# EAGLE board vr98-north-revA (EAGLE 9.6.2)
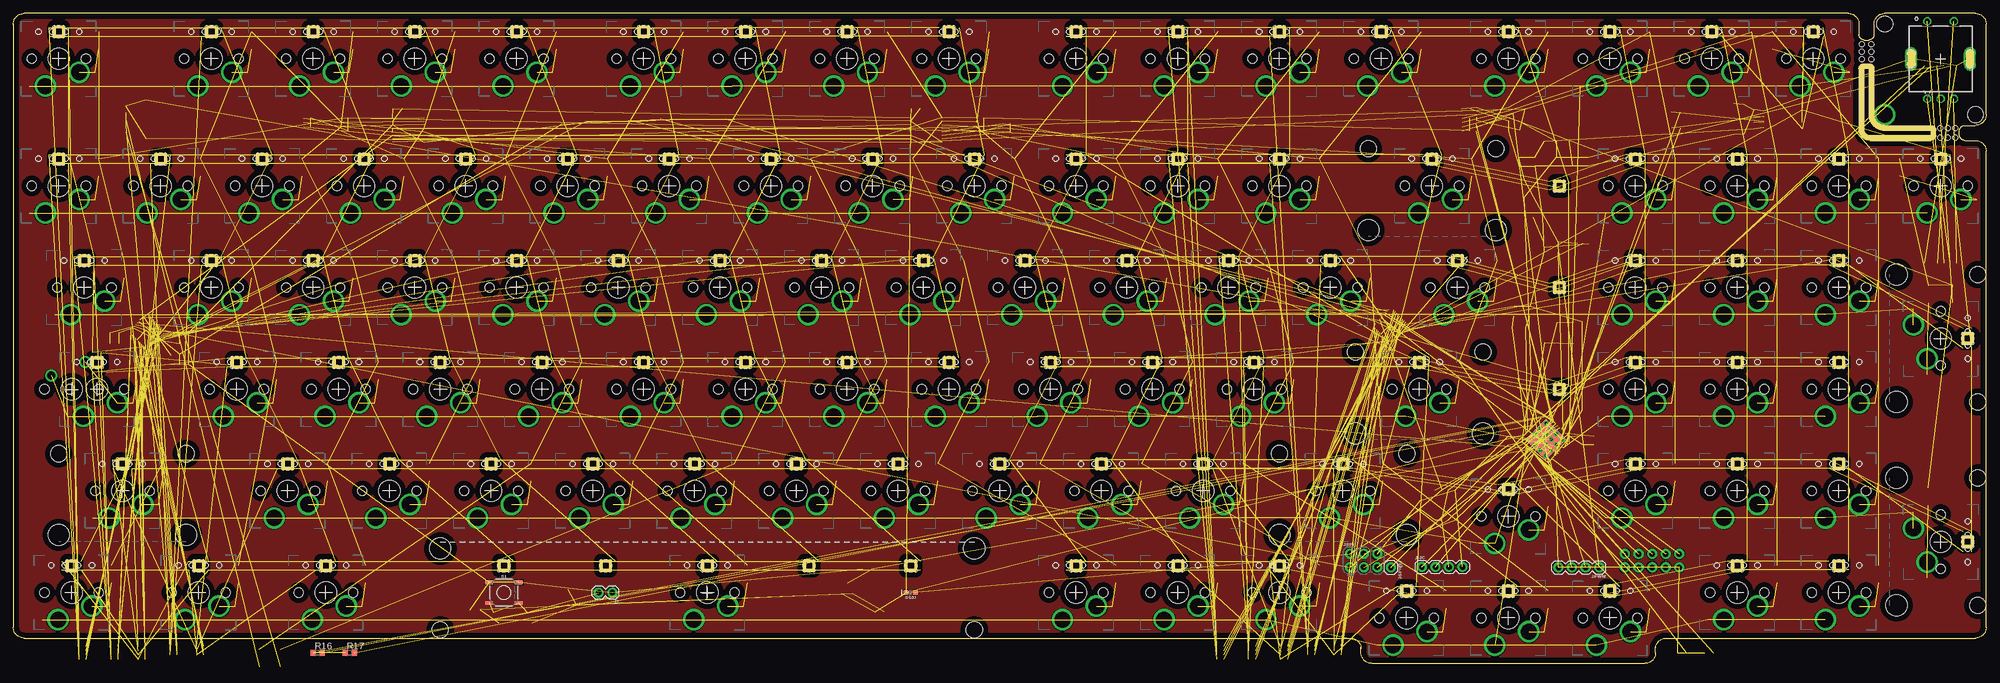
[diagram p4: board, top side]
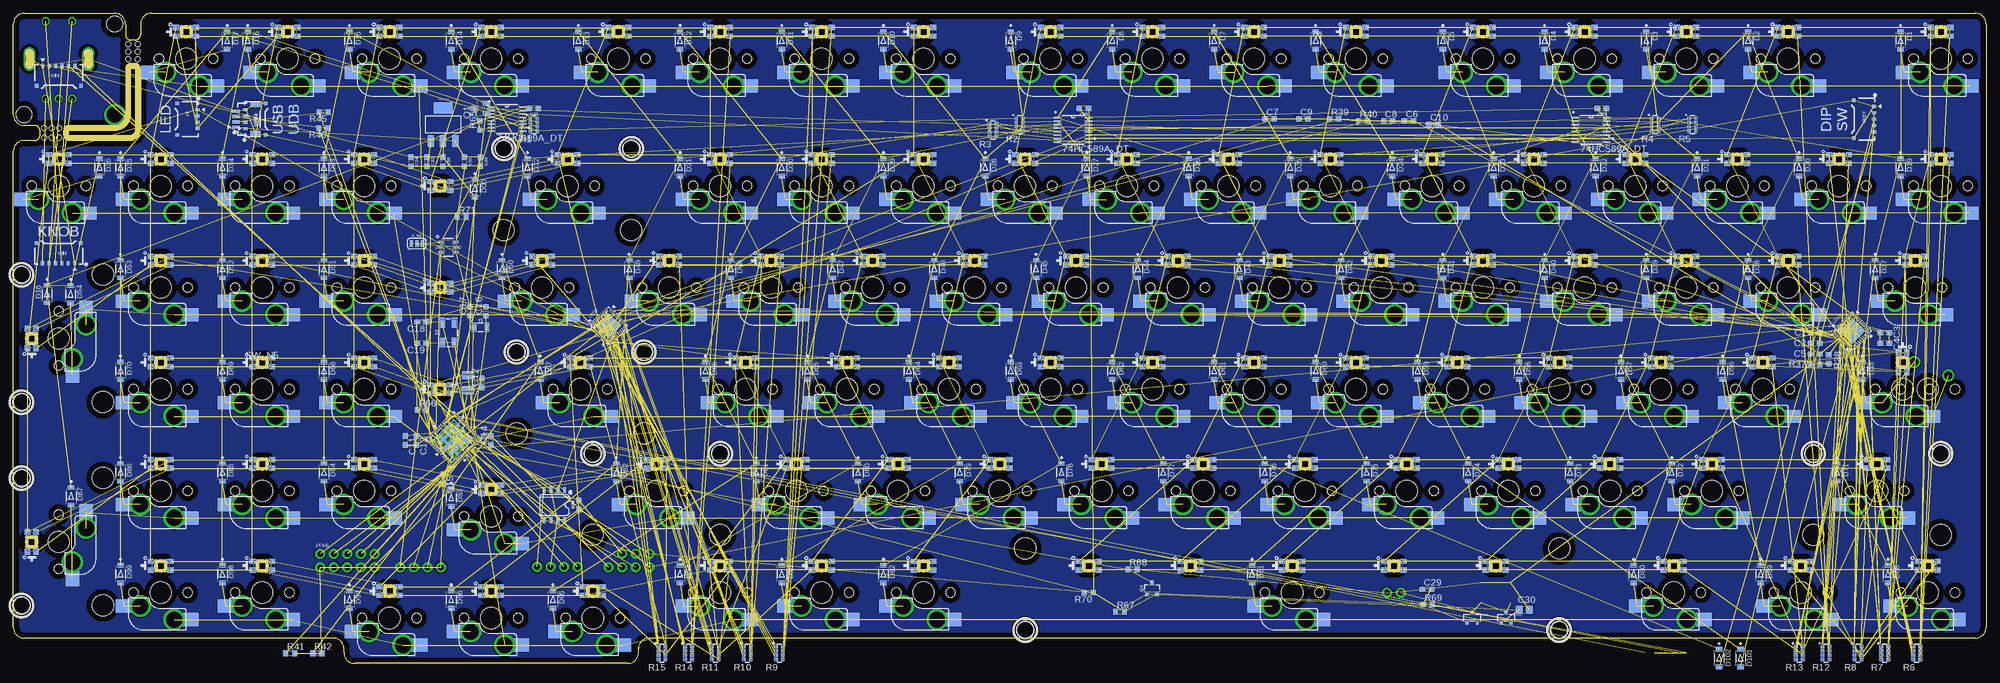
[diagram p5: board, bottom side, seen from below]

Size 369.48 x 121.83 mm. Coordinates in mm from the lower left corner, seen from the top.
Outline: 252.41,2.76 252.41,2 arc90 254.41,0 305.56,0 arc90 307.56,2 307.56,2.76
Outline: 252.41,2.76 252.41,3
Outline: 307.56,2.76 307.56,3
Outline: 307.56,2.76 arc-90 309.56,4.76 367.48,4.76 arc90 369.48,6.76 369.48,96.01 arc90 367.48,98.01 365.48,98.01 arc-90 364.48,99.01 364.48,99.83 arc-90 365.48,100.83 367.48,100.83 arc90 369.48,102.83 369.48,119.83 arc90 367.48,121.83 350.48,121.83 arc90 348.48,119.83 348.48,117.83 arc-90 347.48,116.83 346.66,116.83 arc-90 345.66,117.83 345.66,119.83 arc90 343.66,121.83 2,121.83 arc90 0,119.83 0,6.76 arc90 2,4.76 250.41,4.76 arc-90 252.41,2.76
Outline: 347.66,98.01 359.07,98.01 arc79 360.07,99.01 360.07,99.83 arc90 359.07,100.83 350.48,100.83 arc-90 348.48,102.83 348.48,111.42 arc90 347.48,112.42 346.66,112.42 arc90 345.66,111.42 345.66,100.01 arc90 347.66,98.01
Copper layers (1*16): Top 0.035mm / dielectric 1.5mm / Bottom 0.035mm
Design rules "default": minimum track width 6mil, minimum drill 0.35mm, track to track 6mil, track to pad 6mil, pad to pad 6mil, via to via 6mil, smd to smd 6mil, copper to edge 40mil, drill to drill 6mil, minimum pad ring 10mil, minimum via ring 8mil, stop-mask expansion 4mil, vias tented up to drill 0mil, thermal gap 10mil
Holes 3 mm at 350.48,119.83 367.48,102.83
Holes 1 mm at 346.16,113.22 346.16,114.62 346.16,116.03 347.98,113.22 347.98,114.62 347.98,116.03 363.68,100.33 360.88,98.51 362.27,100.33 360.88,100.33 363.68,98.51 362.27,98.51
Milling: 12 lines

## Footprints (pad centres in the part's own frame; a part is rotated, then mirrored left to right if it is on the bottom)
C0603 = smd 1.1 x 1: 1 -0.85,0; 2 0.85,0
0603 = smd 1.1 x 1: 1 -0.85,0; 2 0.85,0
C0805 = smd 1.3 x 1.5: 1 -0.95,0; 2 0.95,0
SOD-123 = smd 0.914 x 1.219: A 1.638,0; C -1.638,0
LED-0603 = smd 1 x 1: A -0.877,0; C 0.877,0
SOT23-R = smd 0.6 x 0.7: 1 -0.95,-1; 2 0.95,-1; 3 0,1
MX-STABS-200U = hole 3.988: -11.938,8.255; 11.938,8.255 | hole 3.048: -11.938,-6.985; 11.938,-6.985
MX-STABS-625U = hole 3.988: -50,8.255; 50,8.255 | hole 3.048: -50,-6.985; 50,-6.985
1X02 = drill 1.016 pad 1.88: 1 0,0; 2 2.54,0
MOLEX_781710004 = smd 0.6 x 0.85: 1 -1.8,2; 2 -0.6,2; 3 0.6,2; 4 1.8,2 | smd 0.7 x 0.8: NC1 -2.95,-1.775; NC2 2.95,-1.775
SMT-JUMPER_3_1-NC_TRACE_SILK = smd 0.635 x 1.27: 1 -1.016,0; 2 0,0; 3 1.016,0
1X04 = drill 1.016 pad 1.88: 1 0,0; 2 2.54,0; 3 5.08,0; 4 7.62,0
MOLEX_781710005 = smd 0.6 x 0.85: 1 -2.4,2; 2 -1.2,2; 3 0,2; 4 1.2,2; 5 2.4,2 | smd 0.7 x 0.8: NC1 -3.55,-1.775; NC2 3.55,-1.775
2X3-NS = drill 1.016 pad 1.88: 1 -2.54,-1.27; 2 -2.54,1.27; 3 0,-1.27; 4 0,1.27; 5 2.54,-1.27; 6 2.54,1.27
1X01 = drill 1.016 pad 1.88: 1 0,0
2X5_NOSILK = drill 1.016 pad 1.88: 1 0,0; 2 0,2.54; 3 2.54,0; 4 2.54,2.54; 5 5.08,0; 6 5.08,2.54; 7 7.62,0; 8 7.62,2.54; 9 10.16,0; 10 10.16,2.54
L3225M = smd 1.6 x 2.2: 1 -1.4,0; 2 1.4,0
SOT223 = smd 1.219 x 2.235: 1 -2.311,-3.099; 2 0,-3.099; 3 2.311,-3.099 | smd 3.6 x 2.2: 4 0,3.099
SOT23 = smd 1 x 1.4: 1 -0.95,-1.1; 2 0.95,-1.1; 3 0,1.1
SOT23-3 = smd 0.8 x 0.9: 1 -0.95,-1; 2 0.95,-1; 3 0,1.1
R0603X4 = smd 0.7 x 0.6: 1 -0.65,1.2; 2 -0.65,0.4; 3 -0.65,-0.4; 4 -0.65,-1.2; 5 0.65,-1.2; 6 0.65,-0.4; 7 0.65,0.4; 8 0.65,1.2
R0603 = smd 1 x 1.1: 1 -0.85,0; 2 0.85,0
TACTILE_SWITCH_SMD_5.2MM = smd 1.524 x 0.762: 1 -2.794,1.905; 2 2.794,1.905; 3 -2.794,-1.905; 4 2.794,-1.905
MX-5-PIN-HOTSWAP-PAD = smd 3.15 x 2.5 bottom: 1@1 -6.785,2.54; 2@1 5.542,5.08 | drill 3 pad 3.75: 1@2 -3.81,2.54; 2@2 2.54,5.08 | hole 3.988: 0,0 | hole 1.75: -5.08,0; 5.08,0
MX-5-PIN-MILMAX-3305-X-NS = drill 1.5: 1 -3.81,2.54; 2 2.54,5.08 | hole 3.988: 0,0 | hole 1.75: -5.08,0; 5.08,0
ROTARY_EC11E = drill 1.5 pad 2 long: 1 -5.5,0; 2 5.5,0 | drill 0.991 pad 1.499 octagon: A -2.489,-7.493; B 2.489,-7.493; C 0,-7.493; D -2.489,7.01; E 2.489,7.01 | hole 1.5: -5.5,1; -5.5,-1; 5.5,1; 5.5,-1
UFQFPN-48_7X7X0P55MM-THERM = smd 0.813 x 0.305: 1 -3.454,2.75; 2 -3.454,2.25; 3 -3.454,1.75; 4 -3.454,1.25; 5 -3.454,0.75; 6 -3.454,0.25; 7 -3.454,-0.25; 8 -3.454,-0.75; 9 -3.454,-1.25; 10 -3.454,-1.75; 11 -3.454,-2.25; 12 -3.454,-2.75; 25 3.454,-2.75; 26 3.454,-2.25; 27 3.454,-1.75; 28 3.454,-1.25; 29 3.454,-0.75; 30 3.454,-0.25; 31 3.454,0.25; 32 3.454,0.75; 33 3.454,1.25; 34 3.454,1.75; 35 3.454,2.25; 36 3.454,2.75 | smd 0.305 x 0.813: 13 -2.75,-3.454; 14 -2.25,-3.454; 15 -1.75,-3.454; 16 -1.25,-3.454; 17 -0.75,-3.454; 18 -0.25,-3.454; 19 0.25,-3.454; 20 0.75,-3.454; 21 1.25,-3.454; 22 1.75,-3.454; 23 2.25,-3.454; 24 2.75,-3.454; 37 2.75,3.454; 38 2.25,3.454; 39 1.75,3.454; 40 1.25,3.454; 41 0.75,3.454; 42 0.25,3.454; 43 -0.25,3.454; 44 -0.75,3.454; 45 -1.25,3.454; 46 -1.75,3.454; 47 -2.25,3.454; 48 -2.75,3.454 | smd 5 x 5.4: 49 0.2,0 | smd 0.4 x 5: 49@1 -2.5,-0.2 | smd 0.56 x 0.29 rotated 45: 49@2 -2.4,2.4 | smd 5.4 x 5.4 bottom: 49@3 0,0 | drill 0.4: 49@4 -0.711,2.134; 49@5 0.711,2.134; 49@6 2.134,2.134; 49@7 -2.134,0.711; 49@8 -0.711,0.711; 49@9 0.711,0.711; 49@10 2.134,0.711; 49@11 -2.134,-0.711; 49@12 -0.711,-0.711; 49@13 0.711,-0.711; 49@14 2.134,-0.711; 49@15 -2.134,-2.134; 49@16 -0.711,-2.134; 49@17 0.711,-2.134; 49@18 2.134,-2.134
TSSOP16 = smd 1.408 x 0.356: 1 -2.952,2.275; 2 -2.952,1.625; 3 -2.952,0.975; 4 -2.952,0.325; 5 -2.952,-0.325; 6 -2.952,-0.975; 7 -2.952,-1.625; 8 -2.952,-2.275; 9 2.952,-2.275; 10 2.952,-1.625; 11 2.952,-0.975; 12 2.952,-0.325; 13 2.952,0.325; 14 2.952,0.975; 15 2.952,1.625; 16 2.952,2.275
8-SOIC = smd 0.6 x 1.2: 1 -1.905,-2.8; 2 -0.635,-2.8; 3 0.635,-2.8; 4 1.905,-2.8; 5 1.905,2.8; 6 0.635,2.8; 7 -0.635,2.8; 8 -1.905,2.8
SOT-23-THIN-6_DDC_TEX = smd 1.003 x 0.559: 1 -1.378,0.95; 2 -1.378,0; 3 -1.378,-0.95; 4 1.378,-0.95; 5 1.378,0; 6 1.378,0.95
MOLEX_781710006 = smd 0.6 x 0.85: 1 -3,2; 2 -1.8,2; 3 -0.6,2; 4 0.6,2; 5 1.8,2; 6 3,2 | smd 0.7 x 0.8: NC1 -4.15,-1.775; NC2 4.15,-1.775
UQFN40 = smd 0.813 x 0.203: 1 -2.4,1.8; 2 -2.4,1.4; 3 -2.4,1; 4 -2.4,0.6; 5 -2.4,0.2; 6 -2.4,-0.2; 7 -2.4,-0.6; 8 -2.4,-1; 9 -2.4,-1.4; 10 -2.4,-1.8; 21 2.4,-1.8; 22 2.4,-1.4; 23 2.4,-1; 24 2.4,-0.6; 25 2.4,-0.2; 26 2.4,0.2; 27 2.4,0.6; 28 2.4,1; 29 2.4,1.4; 30 2.4,1.8 | smd 0.203 x 0.813: 11 -1.8,-2.4; 12 -1.4,-2.4; 13 -1,-2.4; 14 -0.6,-2.4; 15 -0.2,-2.4; 16 0.2,-2.4; 17 0.6,-2.4; 18 1,-2.4; 19 1.4,-2.4; 20 1.8,-2.4; 31 1.8,2.4; 32 1.4,2.4; 33 1,2.4; 34 0.6,2.4; 35 0.2,2.4; 36 -0.2,2.4; 37 -0.6,2.4; 38 -1,2.4; 39 -1.4,2.4; 40 -1.8,2.4 | smd 3 x 3.4: EPAD 0.225,0 | smd 0.566 x 0.566 rotated 315: EPAD@1 -1.278,1.299 | smd 0.4 x 3: EPAD@2 -1.477,-0.2
JST_SM04B-SRSS-TB_LF_SN = smd 0.6 x 1.35: 1 -1.5,0; 2 -0.5,0; 3 0.5,0; 4 1.5,0 | smd 1.2 x 2: NC1 2.8,-3.675; NC2 -2.8,-3.675
CRYSTAL-SMD-3.2X1.5MM = smd 1 x 1.8: P$1 -1.25,0; P$2 1.25,0
CRYSTAL-SMD-5X3.2-4PAD = smd 1.9 x 1.1: 1 -1.85,-1.15; 2 1.85,-1.15; 3 1.85,1.15; 4 -1.85,1.15
156120M173000 = smd 1.2 x 1: 1 -1.85,0.8; 2 -1.85,-0.8; 3 1.85,-0.8; 4 1.85,0.8 | hole 0.6: -0.85,0.85; -0.85,-0.85; 0.85,0.85; 0.85,-0.85 | hole 2.3: 0,0

## Placement (x,y rotation side)
C1  1uF  [C0603]  32,62 0 bottom
C2  0.1uF  [C0603]  32,60 0 bottom
C3  1uF  [C0603]  19,62 180 bottom
C4  0.1uF  [C0603]  19,60 180 bottom
C5  0.1uF  [C0603]  32,58 0 bottom
C6  1uF  [C0603]  108.08,101.66 0 bottom
C7  0.1uF  [C0603]  134.2,102.04 0 bottom
C8  1uF  [C0603]  112,101.66 0 bottom
C9  0.1uF  [C0603]  127.85,102.04 0 bottom
C10  0.1uF  [C0603]  103.5,101.04 0 bottom
C11  22uF  [C0603]  296.04,41.82 270 bottom
C12  100nF  [C0603]  281.69,52.57 90 bottom
C13  100nF  [C0603]  293.96,41.81 270 bottom
C14  100nF  [C0603]  280.04,41.81 90 bottom
C15  100nF  [C0603]  288.96,34.57 270 bottom
C16  4.3pF  [C0603]  281,66 90 bottom
C17  4.3pF  [C0603]  284,66 90 bottom
C18  12pF  [C0603]  293,64 180 bottom
C19  12pF  [C0603]  293,60 180 bottom
C20  100nF  [0603]  289,94 270 bottom
C21  100nF  [0603]  285,94 270 bottom
C22  22uF  [0603]  292,94 270 bottom
C23  22uF  [0603]  282,94 270 bottom
C24  4.7uF  [0603]  295,94 270 bottom
C25  100nF  [0603]  72,104 180 bottom
C26  100nF  [0603]  169,104 180 bottom
C27  100nF  [0603]  272,104 180 bottom
C28  100nF  [0603]  263.55,29.74 90 bottom
C29  [C0603]  104.71,13.9 0 bottom
C30  100nF  [C0805]  86.48,10.04 0 bottom
D00  B5819W SL  [SOD-123]  283,89 270 bottom
D1  [SOD-123]  16.02,116.77 270 bottom
D2  [SOD-123]  44.59,116.77 270 bottom
D3  [SOD-123]  63.64,116.77 270 bottom
D4  [SOD-123]  82.69,116.77 270 bottom
D5  [SOD-123]  101.74,116.77 270 bottom
D6  [SOD-123]  125.56,116.77 270 bottom
D7  [SOD-123]  144.61,116.77 270 bottom
D8  [SOD-123]  163.66,116.77 270 bottom
D9  [SOD-123]  182.71,116.77 270 bottom
D10  [SOD-123]  206.52,116.77 270 bottom
D11  [SOD-123]  225.57,116.77 270 bottom
D12  [SOD-123]  244.62,116.77 270 bottom
D13  [SOD-123]  263.67,116.77 270 bottom
D14  [SOD-123]  287.48,116.77 270 bottom
D15  [SOD-123]  306.53,116.77 270 bottom
D16  [SOD-123]  325.58,116.77 270 bottom
D17  [SOD-123]  329.43,116.77 270 bottom
D18  [SOD-123]  363.2,69.23 270 bottom
D19  [SOD-123]  16.02,92.96 270 bottom
D20  [SOD-123]  35.07,92.96 270 bottom
D21  [SOD-123]  54.12,92.96 270 bottom
D22  [SOD-123]  73.17,92.96 270 bottom
D23  [SOD-123]  92.22,92.96 270 bottom
D24  [SOD-123]  111.27,92.96 270 bottom
D25  [SOD-123]  130.32,92.96 270 bottom
D26  [SOD-123]  149.37,92.96 270 bottom
D27  [SOD-123]  168.42,92.96 270 bottom
D28  [SOD-123]  187.47,92.96 270 bottom
D29  [SOD-123]  206.52,92.96 270 bottom
D30  [SOD-123]  225.57,92.96 270 bottom
D31  [SOD-123]  244.62,92.96 270 bottom
D32  [SOD-123]  273.19,92.96 270 bottom
D33  [SOD-123]  311.29,92.96 270 bottom
D34  [SOD-123]  330.34,92.96 270 bottom
D35  [SOD-123]  349.39,92.96 270 bottom
D36  [SOD-123]  353.34,92.96 270 bottom
D37  [SOD-123]  20.78,73.91 270 bottom
D38  [SOD-123]  44.59,73.91 270 bottom
D39  [SOD-123]  63.64,73.91 270 bottom
D40  [SOD-123]  82.69,73.91 270 bottom
D41  [SOD-123]  101.74,73.91 270 bottom
D42  [SOD-123]  120.79,73.91 270 bottom
D43  [SOD-123]  139.84,73.91 270 bottom
D44  [SOD-123]  158.89,73.91 270 bottom
D45  [SOD-123]  177.94,73.91 270 bottom
D46  [SOD-123]  196.99,73.91 270 bottom
D47  [SOD-123]  216.04,73.91 270 bottom
D48  [SOD-123]  235.09,73.91 270 bottom
D49  [SOD-123]  254.14,73.91 270 bottom
D50  [SOD-123]  277.96,73.91 270 bottom
D51  [SOD-123]  311.29,73.91 270 bottom
D52  [SOD-123]  330.34,73.91 270 bottom
D53  [SOD-123]  349.39,73.91 270 bottom
D54  [SOD-123]  358.74,69.21 270 bottom
D55  [SOD-123]  23.16,54.86 270 bottom
D56  [SOD-123]  49.36,54.86 270 bottom
D57  [SOD-123]  68.41,54.86 270 bottom
D58  [SOD-123]  87.46,54.86 270 bottom
D59  [SOD-123]  106.51,54.86 270 bottom
D60  [SOD-123]  125.56,54.86 270 bottom
D61  [SOD-123]  144.61,54.86 270 bottom
D62  [SOD-123]  163.66,54.86 270 bottom
D63  [SOD-123]  182.71,54.86 270 bottom
D64  [SOD-123]  201.76,54.86 270 bottom
D65  [SOD-123]  220.81,54.86 270 bottom
D66  [SOD-123]  239.86,54.86 270 bottom
D67  [SOD-123]  270.81,54.86 270 bottom
D68  [SOD-123]  311.29,54.86 270 bottom
D69  [SOD-123]  330.34,54.86 270 bottom
D70  [SOD-123]  349.39,54.86 270 bottom
D71  [SOD-123]  27.93,35.81 270 bottom
D72  [SOD-123]  58.88,35.81 270 bottom
D73  [SOD-123]  77.93,35.81 270 bottom
D74  [SOD-123]  96.98,35.81 270 bottom
D75  [SOD-123]  116.03,35.81 270 bottom
D76  [SOD-123]  135.08,35.81 270 bottom
D77  [SOD-123]  154.13,35.81 270 bottom
D78  [SOD-123]  173.18,35.81 270 bottom
D79  [SOD-123]  192.23,35.81 270 bottom
D80  [SOD-123]  211.28,35.81 270 bottom
D81  [SOD-123]  230.33,35.81 270 bottom
D82  [SOD-123]  256.52,35.81 270 bottom
D83  [SOD-123]  287.48,31.05 270 bottom
D84  [SOD-123]  311.29,35.81 270 bottom
D85  [SOD-123]  330.34,35.81 270 bottom
D86  [SOD-123]  349.39,35.81 270 bottom
D87  [SOD-123]  358.64,31.31 270 bottom
D88  [SOD-123]  18.4,16.76 270 bottom
D89  [SOD-123]  42.21,16.76 270 bottom
D90  [SOD-123]  66.03,16.76 270 bottom
D91  [SOD-123]  137.46,16.76 270 bottom
D92  [SOD-123]  206.52,16.76 270 bottom
D93  [SOD-123]  225.57,16.76 270 bottom
D94  [SOD-123]  244.62,16.76 270 bottom
D95  [SOD-123]  268.43,12 270 bottom
D96  [SOD-123]  287.48,12 270 bottom
D97  [SOD-123]  306.53,12 270 bottom
D98  [SOD-123]  330.34,16.76 270 bottom
D99  [SOD-123]  349.39,16.76 270 bottom
D101  DNP  [SOD-123]  46,1 270 bottom
D102  DNP  [SOD-123]  50,1 270 bottom
D107  BLUE  [LED-0603]  168.07,13.29 180 top
D201  1N4148  [SOT23-R]  96.25,8.6 0 bottom
D202  1N4148  [SOT23-R]  89.9,8.6 0 bottom
H_BSP  MX-STABS-200U  [MX-STABS-200U]  265.7,89.49 180 top
H_ENT  MX-STABS-200U  [MX-STABS-200U]  263.32,51.39 180 top
H_LS  MX-STABS-200U  [MX-STABS-200U]  20.43,32.34 180 top
H_NEN  MX-STABS-200U  [MX-STABS-200U]  360.95,22.81 90 top
H_NP  MX-STABS-200U  [MX-STABS-200U]  360.95,60.91 90 top
H_RS  MX-STABS-200U  [MX-STABS-200U]  249.03,32.34 180 top
H_SPC  MX-STABS-625U  [MX-STABS-625U]  129.97,13.29 0 top
J1  [1X02]  112.19,13.29 180 top
J2  [MOLEX_781710004]  337,102 270 bottom
J_5V  5V SRC SELECT  [SMT-JUMPER_3_1-NC_TRACE_SILK]  293.92,78.66 0 bottom
JI2C  [1X04]  263.8,18.1 0 top
JKEY  MOLEX_0781710005  [MOLEX_781710005]  23,102 270 bottom
JPWM  [1X04]  297,18 180 top
JSPI  DNP  [2X3-NS]  252.9,19.3 0 top
JSPI@2  [1X01]  258,18 270 top
JTAG  DNP  [2X5_NOSILK]  312,18 0 bottom
L1  10uH ±10%  [L3225M]  284.31,52.59 90 bottom
LM1117  AMS1117-3.3  [SOT223]  289,101 0 bottom
Q1  2N7002  [SOT23]  282,104 90 bottom
Q2  DMG2305UX-7  [SOT23-3]  156.23,14.04 0 bottom
R1  10K  [R0603X4]  272,101 0 bottom
R2  10K  [R0603X4]  181,101 0 bottom
R3  10K  [R0603X4]  186,100 0 bottom
R4  10K  [R0603X4]  62,101 0 bottom
R5  10K  [R0603X4]  55,101 0 bottom
R6  20R  [R0603X4]  13,2 0 bottom
R7  20R  [R0603X4]  19,2 0 bottom
R8  20R  [R0603X4]  24,2 0 bottom
R9  20R  [R0603X4]  226,2 0 bottom
R10  20R  [R0603X4]  232,2 0 bottom
R11  20R  [R0603X4]  238,2 0 bottom
R12  51R  [R0603X4]  30,2 0 bottom
R13  51R  [R0603X4]  35,2 0 bottom
R14  51R  [R0603X4]  243,2 0 bottom
R15  51R  [R0603X4]  248,2 0 bottom
R16  5.1K  [R0603]  57,2 0 top
R17  5.1K  [R0603]  63,2 0 top
R37  100K  [R0603]  32,56 0 bottom
R38  10K  [R0603]  29.5,57 90 bottom
R39  100K  [R0603]  122.1,102.04 0 bottom
R40  10K  [R0603]  116.72,101.66 0 bottom
R41  4K7  [R0603]  317.63,1.9 0 bottom
R42  4K7  [R0603]  312.55,1.9 0 bottom
R45  10R  [R0603]  311.36,103.34 180 bottom
R46  10R  [R0603]  311.44,100.34 180 bottom
R65  5.1K  [R0603]  282.1,100.8 90 bottom
R66  10K  [R0603]  292.97,47.5 0 bottom
R67  100K  [R0603]  162.22,9.66 0 bottom
R68  100K  [R0603]  159.87,17.66 0 bottom
R69  /DNP/  [R0603]  104.6,11.04 0 bottom
R70  1K  [R0603]  168.07,13.29 180 bottom
R71  1K  [R0603]  285.52,83.66 0 bottom
S1  Reset  [TACTILE_SWITCH_SMD_5.2MM]  91.87,13.29 0 top
SW_0  MX-5-PIN-HOTSWAP-PAD  [MX-5-PIN-HOTSWAP-PAD]  199.03,89.49 180 top
SW_1  MX-5-PIN-HOTSWAP-PAD  [MX-5-PIN-HOTSWAP-PAD]  27.57,89.49 180 top
SW_2  MX-5-PIN-HOTSWAP-PAD  [MX-5-PIN-HOTSWAP-PAD]  46.62,89.49 180 top
SW_3  MX-5-PIN-HOTSWAP-PAD  [MX-5-PIN-HOTSWAP-PAD]  65.67,89.49 180 top
SW_4  MX-5-PIN-HOTSWAP-PAD  [MX-5-PIN-HOTSWAP-PAD]  84.72,89.49 180 top
SW_5  MX-5-PIN-HOTSWAP-PAD  [MX-5-PIN-HOTSWAP-PAD]  103.78,89.49 180 top
SW_6  MX-5-PIN-HOTSWAP-PAD  [MX-5-PIN-HOTSWAP-PAD]  122.83,89.49 180 top
SW_7  MX-5-PIN-HOTSWAP-PAD  [MX-5-PIN-HOTSWAP-PAD]  141.88,89.49 180 top
SW_8  MX-5-PIN-HOTSWAP-PAD  [MX-5-PIN-HOTSWAP-PAD]  160.93,89.49 180 top
SW_9  MX-5-PIN-HOTSWAP-PAD  [MX-5-PIN-HOTSWAP-PAD]  179.97,89.49 180 top
SW_A  MX-5-PIN-HOTSWAP-PAD  [MX-5-PIN-HOTSWAP-PAD]  41.86,51.39 180 top
SW_B  MX-5-PIN-HOTSWAP-PAD  [MX-5-PIN-HOTSWAP-PAD]  127.59,32.34 180 top
SW_BSP  MX-5-PIN-HOTSWAP-PAD  [MX-5-PIN-HOTSWAP-PAD]  265.7,89.49 180 top
SW_C  MX-5-PIN-HOTSWAP-PAD  [MX-5-PIN-HOTSWAP-PAD]  89.49,32.34 180 top
SW_CB  MX-5-PIN-HOTSWAP-PAD  [MX-5-PIN-HOTSWAP-PAD]  246.65,70.44 180 top
SW_CL  MX-5-PIN-HOTSWAP-PAD  [MX-5-PIN-HOTSWAP-PAD]  15.67,51.39 180 top
SW_CL2  MX-5-PIN-MILMAX-3305-XNO-SILK  [MX-5-PIN-MILMAX-3305-X-NS]  10.91,51.39 0 top
SW_CM  MX-5-PIN-HOTSWAP-PAD  [MX-5-PIN-HOTSWAP-PAD]  184.74,32.34 180 top
SW_CS  MX-5-PIN-HOTSWAP-PAD  [MX-5-PIN-HOTSWAP-PAD]  213.31,51.39 180 top
SW_D  MX-5-PIN-HOTSWAP-PAD  [MX-5-PIN-HOTSWAP-PAD]  79.96,51.39 180 top
SW_DN  MX-5-PIN-HOTSWAP-PAD  [MX-5-PIN-HOTSWAP-PAD]  279.99,8.53 180 top
SW_DP  MX-5-PIN-HOTSWAP-PAD  [MX-5-PIN-HOTSWAP-PAD]  270.46,70.44 180 top
SW_DSH  MX-5-PIN-HOTSWAP-PAD  [MX-5-PIN-HOTSWAP-PAD]  322.85,89.49 180 top
SW_DT  MX-5-PIN-HOTSWAP-PAD  [MX-5-PIN-HOTSWAP-PAD]  203.79,32.34 180 top
SW_E  MX-5-PIN-HOTSWAP-PAD  [MX-5-PIN-HOTSWAP-PAD]  75.2,70.44 180 top
SW_ENT  MX-5-PIN-HOTSWAP-PAD  [MX-5-PIN-HOTSWAP-PAD]  263.32,51.39 180 top
SW_EP  MX-5-PIN-HOTSWAP-PAD  [MX-5-PIN-HOTSWAP-PAD]  237.12,89.49 180 top
SW_ESC  MX-5-PIN-HOTSWAP-PAD  [MX-5-PIN-HOTSWAP-PAD]  8.53,113.3 180 top
SW_F  MX-5-PIN-HOTSWAP-PAD  [MX-5-PIN-HOTSWAP-PAD]  99.01,51.39 180 top
SW_F1  MX-5-PIN-HOTSWAP-PAD  [MX-5-PIN-HOTSWAP-PAD]  37.1,113.3 180 top
SW_F2  MX-5-PIN-HOTSWAP-PAD  [MX-5-PIN-HOTSWAP-PAD]  56.15,113.3 180 top
SW_F3  MX-5-PIN-HOTSWAP-PAD  [MX-5-PIN-HOTSWAP-PAD]  75.2,113.3 180 top
SW_F4  MX-5-PIN-HOTSWAP-PAD  [MX-5-PIN-HOTSWAP-PAD]  94.25,113.3 180 top
SW_F5  MX-5-PIN-HOTSWAP-PAD  [MX-5-PIN-HOTSWAP-PAD]  118.06,113.3 180 top
SW_F6  MX-5-PIN-HOTSWAP-PAD  [MX-5-PIN-HOTSWAP-PAD]  137.11,113.3 180 top
SW_F7  MX-5-PIN-HOTSWAP-PAD  [MX-5-PIN-HOTSWAP-PAD]  156.16,113.3 180 top
SW_F8  MX-5-PIN-HOTSWAP-PAD  [MX-5-PIN-HOTSWAP-PAD]  175.21,113.3 180 top
SW_F9  MX-5-PIN-HOTSWAP-PAD  [MX-5-PIN-HOTSWAP-PAD]  199.03,113.3 180 top
SW_F10  MX-5-PIN-HOTSWAP-PAD  [MX-5-PIN-HOTSWAP-PAD]  218.07,113.3 180 top
SW_F11  MX-5-PIN-HOTSWAP-PAD  [MX-5-PIN-HOTSWAP-PAD]  237.12,113.3 180 top
SW_F12  MX-5-PIN-HOTSWAP-PAD  [MX-5-PIN-HOTSWAP-PAD]  256.18,113.3 180 top
SW_F13  MX-5-PIN-HOTSWAP-PAD  [MX-5-PIN-HOTSWAP-PAD]  279.99,113.3 180 top
SW_F14  MX-5-PIN-HOTSWAP-PAD  [MX-5-PIN-HOTSWAP-PAD]  299.04,113.3 180 top
SW_F15  MX-5-PIN-HOTSWAP-PAD  [MX-5-PIN-HOTSWAP-PAD]  318.09,113.3 180 top
SW_F16  MX-5-PIN-HOTSWAP-PAD  [MX-5-PIN-HOTSWAP-PAD]  337.14,113.3 180 top
SW_F17  EC11E15244B2  [ROTARY_EC11E]  360.95,113.3 0 top
SW_FS  MX-5-PIN-HOTSWAP-PAD  [MX-5-PIN-HOTSWAP-PAD]  222.84,32.34 180 top
SW_G  MX-5-PIN-HOTSWAP-PAD  [MX-5-PIN-HOTSWAP-PAD]  118.06,51.39 180 top
SW_H  MX-5-PIN-HOTSWAP-PAD  [MX-5-PIN-HOTSWAP-PAD]  137.11,51.39 180 top
SW_I  MX-5-PIN-HOTSWAP-PAD  [MX-5-PIN-HOTSWAP-PAD]  170.45,70.44 180 top
SW_J  MX-5-PIN-HOTSWAP-PAD  [MX-5-PIN-HOTSWAP-PAD]  156.16,51.39 180 top
SW_K  MX-5-PIN-HOTSWAP-PAD  [MX-5-PIN-HOTSWAP-PAD]  175.21,51.39 180 top
SW_L  MX-5-PIN-HOTSWAP-PAD  [MX-5-PIN-HOTSWAP-PAD]  194.26,51.39 180 top
SW_LA  MX-5-PIN-HOTSWAP-PAD  [MX-5-PIN-HOTSWAP-PAD]  58.53,13.29 180 top
SW_LC  MX-5-PIN-HOTSWAP-PAD  [MX-5-PIN-HOTSWAP-PAD]  10.91,13.29 180 top
SW_LF  MX-5-PIN-HOTSWAP-PAD  [MX-5-PIN-HOTSWAP-PAD]  260.94,8.53 180 top
SW_LS  MX-5-PIN-HOTSWAP-PAD  [MX-5-PIN-HOTSWAP-PAD]  20.43,32.34 180 top
SW_LW  MX-5-PIN-HOTSWAP-PAD  [MX-5-PIN-HOTSWAP-PAD]  34.72,13.29 180 top
SW_M  MX-5-PIN-HOTSWAP-PAD  [MX-5-PIN-HOTSWAP-PAD]  165.69,32.34 180 top
SW_MIN  MX-5-PIN-HOTSWAP-PAD  [MX-5-PIN-HOTSWAP-PAD]  360.95,89.49 180 top
SW_MU  MX-5-PIN-HOTSWAP-PAD  [MX-5-PIN-HOTSWAP-PAD]  218.07,89.49 180 top
SW_MUL  MX-5-PIN-HOTSWAP-PAD  [MX-5-PIN-HOTSWAP-PAD]  341.9,89.49 180 top
SW_N  MX-5-PIN-HOTSWAP-PAD  [MX-5-PIN-HOTSWAP-PAD]  146.64,32.34 180 top
SW_N0  MX-5-PIN-HOTSWAP-PAD  [MX-5-PIN-HOTSWAP-PAD]  322.85,13.29 180 top
SW_N1  MX-5-PIN-HOTSWAP-PAD  [MX-5-PIN-HOTSWAP-PAD]  303.8,32.34 180 top
SW_N2  MX-5-PIN-HOTSWAP-PAD  [MX-5-PIN-HOTSWAP-PAD]  322.85,32.34 180 top
SW_N3  MX-5-PIN-HOTSWAP-PAD  [MX-5-PIN-HOTSWAP-PAD]  341.9,32.34 180 top
SW_N4  MX-5-PIN-HOTSWAP-PAD  [MX-5-PIN-HOTSWAP-PAD]  303.8,51.39 180 top
SW_N5  MX-5-PIN-HOTSWAP-PAD  [MX-5-PIN-HOTSWAP-PAD]  322.85,51.39 180 top
SW_N6  MX-5-PIN-HOTSWAP-PAD  [MX-5-PIN-HOTSWAP-PAD]  341.9,51.39 180 top
SW_N7  MX-5-PIN-HOTSWAP-PAD  [MX-5-PIN-HOTSWAP-PAD]  303.8,70.44 180 top
SW_N8  MX-5-PIN-HOTSWAP-PAD  [MX-5-PIN-HOTSWAP-PAD]  322.85,70.44 180 top
SW_N9  MX-5-PIN-HOTSWAP-PAD  [MX-5-PIN-HOTSWAP-PAD]  341.9,70.44 180 top
SW_ND  MX-5-PIN-HOTSWAP-PAD  [MX-5-PIN-HOTSWAP-PAD]  341.9,13.29 180 top
SW_NEN  MX-5-PIN-HOTSWAP-PAD  [MX-5-PIN-HOTSWAP-PAD]  360.95,22.81 90 top
SW_NP  MX-5-PIN-HOTSWAP-PAD  [MX-5-PIN-HOTSWAP-PAD]  360.95,60.91 90 top
SW_NUM  MX-5-PIN-HOTSWAP-PAD  [MX-5-PIN-HOTSWAP-PAD]  303.8,89.49 180 top
SW_O  MX-5-PIN-HOTSWAP-PAD  [MX-5-PIN-HOTSWAP-PAD]  189.5,70.44 180 top
SW_OB  MX-5-PIN-HOTSWAP-PAD  [MX-5-PIN-HOTSWAP-PAD]  227.6,70.44 180 top
SW_P  MX-5-PIN-HOTSWAP-PAD  [MX-5-PIN-HOTSWAP-PAD]  208.55,70.44 180 top
SW_Q  MX-5-PIN-HOTSWAP-PAD  [MX-5-PIN-HOTSWAP-PAD]  37.1,70.44 180 top
SW_QU  MX-5-PIN-HOTSWAP-PAD  [MX-5-PIN-HOTSWAP-PAD]  232.36,51.39 180 top
SW_R  MX-5-PIN-HOTSWAP-PAD  [MX-5-PIN-HOTSWAP-PAD]  94.25,70.44 180 top
SW_RA  MX-5-PIN-HOTSWAP-PAD  [MX-5-PIN-HOTSWAP-PAD]  199.03,13.29 180 top
SW_RC  MX-5-PIN-HOTSWAP-PAD  [MX-5-PIN-HOTSWAP-PAD]  237.12,13.29 180 top
SW_RS  MX-5-PIN-HOTSWAP-PAD  [MX-5-PIN-HOTSWAP-PAD]  249.03,32.34 180 top
SW_RT  MX-5-PIN-HOTSWAP-PAD  [MX-5-PIN-HOTSWAP-PAD]  299.04,8.53 180 top
SW_RW  MX-5-PIN-HOTSWAP-PAD  [MX-5-PIN-HOTSWAP-PAD]  218.07,13.29 180 top
SW_S  MX-5-PIN-HOTSWAP-PAD  [MX-5-PIN-HOTSWAP-PAD]  60.91,51.39 180 top
SW_SPC  MX-5-PIN-HOTSWAP-PAD  [MX-5-PIN-HOTSWAP-PAD]  129.97,13.29 180 top
SW_T  MX-5-PIN-HOTSWAP-PAD  [MX-5-PIN-HOTSWAP-PAD]  113.3,70.44 180 top
SW_TAB  MX-5-PIN-HOTSWAP-PAD  [MX-5-PIN-HOTSWAP-PAD]  13.29,70.44 180 top
SW_TDL  MX-5-PIN-HOTSWAP-PAD  [MX-5-PIN-HOTSWAP-PAD]  8.53,89.49 180 top
SW_U  MX-5-PIN-HOTSWAP-PAD  [MX-5-PIN-HOTSWAP-PAD]  151.4,70.44 180 top
SW_UP  MX-5-PIN-HOTSWAP-PAD  [MX-5-PIN-HOTSWAP-PAD]  279.99,27.57 180 top
SW_V  MX-5-PIN-HOTSWAP-PAD  [MX-5-PIN-HOTSWAP-PAD]  108.54,32.34 180 top
SW_W  MX-5-PIN-HOTSWAP-PAD  [MX-5-PIN-HOTSWAP-PAD]  56.15,70.44 180 top
SW_X  MX-5-PIN-HOTSWAP-PAD  [MX-5-PIN-HOTSWAP-PAD]  70.44,32.34 180 top
SW_Y  MX-5-PIN-HOTSWAP-PAD  [MX-5-PIN-HOTSWAP-PAD]  132.35,70.44 180 top
SW_Z  MX-5-PIN-HOTSWAP-PAD  [MX-5-PIN-HOTSWAP-PAD]  51.39,32.34 180 top
U1  STM32F411CEU7THERM  [UFQFPN-48_7X7X0P55MM-THERM]  287,42 225 bottom
U2  74HC589A_DT  [TSSOP16]  74,100 0 bottom
U3  74HC589A_DT  [TSSOP16]  171,100 0 bottom
U4  74HC589A_DT  [TSSOP16]  277,102 0 bottom
U5  M25C  [8-SOIC]  268.15,29.69 180 bottom
U6  TPS22995H-Q1  [SOT-23-THIN-6_DDC_TEX]  288,78 0 bottom
U$1  MOLEX_0781710006  [MOLEX_781710006]  361,77 180 bottom
U$2  MOLEX_0781710006  [MOLEX_781710006]  360.95,110 0 bottom
U_LED1  IS31FL3743B  [UQFN40]  25.05,62.29 45 bottom
U_LED2  IS31FL3743B  [UQFN40]  258,63.29 45 bottom
UDB1  [MOLEX_781710004]  324,102 90 bottom
UDB2  [JST_SM04B-SRSS-TB_LF_SN]  327.8,102 90 bottom
Y1  32.768kHz ±20ppm 6pF  [CRYSTAL-SMD-3.2X1.5MM]  282,63 0 bottom
Y2  25MHz 9pF  [CRYSTAL-SMD-5X3.2-4PAD]  288,62 90 bottom
Z1  156120M173000  [156120M173000]  8.53,118.35 0 bottom
Z2  156120M173000  [156120M173000]  37.1,118.35 0 bottom
Z3  156120M173000  [156120M173000]  56.15,118.35 0 bottom
Z4  156120M173000  [156120M173000]  75.2,118.35 0 bottom
Z5  156120M173000  [156120M173000]  94.25,118.35 0 bottom
Z6  156120M173000  [156120M173000]  118.06,118.35 0 bottom
Z7  156120M173000  [156120M173000]  137.11,118.35 0 bottom
Z8  156120M173000  [156120M173000]  156.16,118.35 0 bottom
Z9  156120M173000  [156120M173000]  175.21,118.35 0 bottom
Z10  156120M173000  [156120M173000]  199.03,118.35 0 bottom
Z11  156120M173000  [156120M173000]  218.07,118.35 0 bottom
Z12  156120M173000  [156120M173000]  237.12,118.35 0 bottom
Z13  156120M173000  [156120M173000]  256.18,118.35 0 bottom
Z14  156120M173000  [156120M173000]  279.99,118.35 0 bottom
Z15  156120M173000  [156120M173000]  299.04,118.35 0 bottom
Z16  156120M173000  [156120M173000]  318.09,118.35 0 bottom
Z17  156120M173000  [156120M173000]  337.14,118.35 0 bottom
Z19  DNP  [156120M173000]  8.53,94.54 0 bottom
Z20  156120M173000  [156120M173000]  27.57,94.54 0 bottom
Z21  156120M173000  [156120M173000]  46.62,94.54 0 bottom
Z22  156120M173000  [156120M173000]  65.67,94.54 0 bottom
Z23  156120M173000  [156120M173000]  84.72,94.54 0 bottom
Z24  156120M173000  [156120M173000]  103.78,94.54 0 bottom
Z25  156120M173000  [156120M173000]  122.83,94.54 0 bottom
Z26  156120M173000  [156120M173000]  141.88,94.54 0 bottom
Z27  156120M173000  [156120M173000]  160.93,94.54 0 bottom
Z28  156120M173000  [156120M173000]  179.97,94.54 0 bottom
Z29  156120M173000  [156120M173000]  199.03,94.54 0 bottom
Z30  156120M173000  [156120M173000]  218.07,94.54 0 bottom
Z31  156120M173000  [156120M173000]  237.12,94.54 0 bottom
Z32  156120M173000  [156120M173000]  265.7,94.54 0 bottom
Z33  156120M173000  [156120M173000]  303.8,94.54 0 bottom
Z34  156120M173000  [156120M173000]  322.85,94.54 0 bottom
Z35  156120M173000  [156120M173000]  341.9,94.54 0 bottom
Z36  156120M173000  [156120M173000]  360.95,94.54 0 bottom
Z37  156120M173000  [156120M173000]  13.29,75.49 0 bottom
Z38  156120M173000  [156120M173000]  37.1,75.49 0 bottom
Z39  156120M173000  [156120M173000]  56.15,75.49 0 bottom
Z40  156120M173000  [156120M173000]  75.2,75.49 0 bottom
Z41  156120M173000  [156120M173000]  94.25,75.49 0 bottom
Z42  156120M173000  [156120M173000]  113.3,75.49 0 bottom
Z43  156120M173000  [156120M173000]  132.35,75.49 0 bottom
Z44  156120M173000  [156120M173000]  151.4,75.49 0 bottom
Z45  156120M173000  [156120M173000]  170.45,75.49 0 bottom
Z46  156120M173000  [156120M173000]  189.5,75.49 0 bottom
Z47  156120M173000  [156120M173000]  208.55,75.49 0 bottom
Z48  156120M173000  [156120M173000]  227.6,75.49 0 bottom
Z49  156120M173000  [156120M173000]  246.65,75.49 0 bottom
Z50  156120M173000  [156120M173000]  270.46,75.49 0 bottom
Z51  156120M173000  [156120M173000]  303.8,75.49 0 bottom
Z52  156120M173000  [156120M173000]  322.85,75.49 0 bottom
Z53  156120M173000  [156120M173000]  341.9,75.49 0 bottom
Z54  156120M173000  [156120M173000]  366,60.91 90 bottom
Z55  156120M173000  [156120M173000]  15.67,56.44 270 bottom
Z56  156120M173000  [156120M173000]  41.86,56.44 0 bottom
Z57  156120M173000  [156120M173000]  60.91,56.44 0 bottom
Z58  156120M173000  [156120M173000]  79.96,56.44 0 bottom
Z59  156120M173000  [156120M173000]  99.01,56.44 0 bottom
Z60  156120M173000  [156120M173000]  118.06,56.44 0 bottom
Z61  156120M173000  [156120M173000]  137.11,56.44 0 bottom
Z62  156120M173000  [156120M173000]  156.16,56.44 0 bottom
Z63  156120M173000  [156120M173000]  175.21,56.44 0 bottom
Z64  156120M173000  [156120M173000]  194.26,56.44 0 bottom
Z65  156120M173000  [156120M173000]  213.31,56.44 0 bottom
Z66  156120M173000  [156120M173000]  232.36,56.44 0 bottom
Z67  156120M173000  [156120M173000]  263.32,56.44 0 bottom
Z68  156120M173000  [156120M173000]  303.8,56.44 0 bottom
Z69  156120M173000  [156120M173000]  322.85,56.44 0 bottom
Z70  156120M173000  [156120M173000]  341.9,56.44 0 bottom
Z71  156120M173000  [156120M173000]  20.43,37.39 0 bottom
Z72  156120M173000  [156120M173000]  51.39,37.39 0 bottom
Z73  156120M173000  [156120M173000]  70.44,37.39 0 bottom
Z74  156120M173000  [156120M173000]  89.49,37.39 0 bottom
Z75  156120M173000  [156120M173000]  108.54,37.39 0 bottom
Z76  156120M173000  [156120M173000]  127.59,37.39 0 bottom
Z77  156120M173000  [156120M173000]  146.64,37.39 0 bottom
Z78  156120M173000  [156120M173000]  165.69,37.39 0 bottom
Z79  156120M173000  [156120M173000]  184.74,37.39 0 bottom
Z80  156120M173000  [156120M173000]  203.79,37.39 0 bottom
Z81  156120M173000  [156120M173000]  222.84,37.39 0 bottom
Z82  156120M173000  [156120M173000]  249.03,37.39 0 bottom
Z83  156120M173000  [156120M173000]  279.99,32.62 0 bottom
Z84  156120M173000  [156120M173000]  303.8,37.39 0 bottom
Z85  156120M173000  [156120M173000]  322.85,37.39 0 bottom
Z86  156120M173000  [156120M173000]  341.9,37.39 0 bottom
Z87  156120M173000  [156120M173000]  366,22.81 90 bottom
Z88  156120M173000  [156120M173000]  10.91,18.34 0 bottom
Z89  156120M173000  [156120M173000]  34.72,18.34 0 bottom
Z90  156120M173000  [156120M173000]  58.53,18.34 0 bottom
Z91  156120M173000  [156120M173000]  129.97,18.34 0 bottom
Z92  156120M173000  [156120M173000]  199.03,18.34 0 bottom
Z93  156120M173000  [156120M173000]  218.07,18.34 0 bottom
Z94  156120M173000  [156120M173000]  237.12,18.34 0 bottom
Z95  156120M173000  [156120M173000]  260.94,13.57 0 bottom
Z96  156120M173000  [156120M173000]  279.99,13.57 0 bottom
Z97  156120M173000  [156120M173000]  299.04,13.57 0 bottom
Z98  156120M173000  [156120M173000]  322.85,18.34 0 bottom
Z99  156120M173000  [156120M173000]  341.9,18.34 0 bottom
Z101  156120M173000  [156120M173000]  289.51,89.49 0 bottom
Z102  156120M173000  [156120M173000]  289.51,70.44 0 bottom
Z103  156120M173000  [156120M173000]  289.51,51.39 0 bottom
Z104  156120M173000  [156120M173000]  91.87,18.34 0 bottom
Z105  156120M173000  [156120M173000]  110.92,18.34 0 bottom
Z106  156120M173000  [156120M173000]  149.02,18.34 0 bottom
Z107  156120M173000  [156120M173000]  168.07,18.34 0 bottom

## Tracks (layer width: path | path; a pad name or v marks a point on that pad's centre or on a via)
!BOOT  (3 unrouted)
!RESET  (3 unrouted)
AUX_CS  (1 unrouted)
AUX_DC  (1 unrouted)
BLU1  (9 unrouted)
BLU2  (10 unrouted)
BLU3  (9 unrouted)
BLU4  (9 unrouted)
BLU5  (8 unrouted)
BLU6  (8 unrouted)
BLU7  (9 unrouted)
BLU8  (9 unrouted)
BLU9  (10 unrouted)
BLU10  (8 unrouted)
BLU11  (9 unrouted)
BLU12  (8 unrouted)
BOOT0  (2 unrouted)
BOOT1  (1 unrouted)
COL0  (7 unrouted)
COL1  (6 unrouted)
COL2  (7 unrouted)
COL3  (6 unrouted)
COL4  (7 unrouted)
COL5  (7 unrouted)
COL6  (7 unrouted)
COL7  (6 unrouted)
COL8  (7 unrouted)
COL9  (7 unrouted)
COL10  (7 unrouted)
COL11  (7 unrouted)
COL12  (6 unrouted)
COL13  (7 unrouted)
COL14  (6 unrouted)
COL15  (7 unrouted)
COL16  (7 unrouted)
COL17  (5 unrouted)
EE_CS  (1 unrouted)
ENC_A  (2 unrouted)
ENC_B  (2 unrouted)
GND  (105 unrouted)
  pour Bottom: 0,121.83 0,4.76 252.41,4.76 252.41,0 307.56,0 307.56,4.76 369.48,4.76 369.48,121.83
  pour Top: 0,121.83 0,4.76 252.41,4.76 252.41,0 307.56,0 307.56,4.76 369.48,4.76 369.48,121.83
GND2  (17 unrouted)
GRN1  (9 unrouted)
GRN2  (10 unrouted)
GRN3  (9 unrouted)
GRN4  (9 unrouted)
GRN5  (8 unrouted)
GRN6  (8 unrouted)
GRN7  (9 unrouted)
GRN8  (9 unrouted)
GRN9  (10 unrouted)
GRN10  (8 unrouted)
GRN11  (9 unrouted)
GRN12  (8 unrouted)
J_RST  (1 unrouted)
J_TCK  (1 unrouted)
J_TDI  (1 unrouted)
J_TDO  (1 unrouted)
J_TMS  (1 unrouted)
K_BSP  (2 unrouted)
K_CL  (3 unrouted)
K_DP  (2 unrouted)
K_ENT  (2 unrouted)
K_LS  (2 unrouted)
LATCH  (7 unrouted)
LED  (1 unrouted)
LED1  (6 unrouted)
LED1_CS  (1 unrouted)
LED2  (2 unrouted)
LED2_CS  (1 unrouted)
LED3  (6 unrouted)
LED4  (6 unrouted)
LED5  (6 unrouted)
LED6  (6 unrouted)
LED7  (6 unrouted)
LED8  (6 unrouted)
LED9  (5 unrouted)
LED10  (4 unrouted)
LED11  (6 unrouted)
LED12  (6 unrouted)
LED13  (6 unrouted)
LED14  (5 unrouted)
LED15  (3 unrouted)
LED16  (6 unrouted)
LED17  (5 unrouted)
LED18  (6 unrouted)
LED19  (6 unrouted)
LED20  (4 unrouted)
LED_PWR_EN  (1 unrouted)
LED_SBD  (5 unrouted)
LOAD_SWITCH_OUT  (1 unrouted)
MATRIX_CS  (4 unrouted)
MISO  (5 unrouted)
MOSI  (4 unrouted)
N$2  (2 unrouted)
N$3  (via drill 3)
  other vias: 350.48,102.83
N$25  (2 unrouted)
N$26  (2 unrouted)
N$27  (2 unrouted)
N$28  (2 unrouted)
N$29  (2 unrouted)
N$30  (2 unrouted)
N$31  (2 unrouted)
N$32  (2 unrouted)
N$33  (2 unrouted)
N$34  (2 unrouted)
N$35  (2 unrouted)
N$36  (2 unrouted)
N$37  (2 unrouted)
N$38  (2 unrouted)
N$39  (2 unrouted)
N$40  (2 unrouted)
N$41  (2 unrouted)
N$42  (2 unrouted)
N$43  (2 unrouted)
N$44  (2 unrouted)
N$45  (2 unrouted)
N$46  (2 unrouted)
N$47  (2 unrouted)
N$48  (2 unrouted)
N$49  (2 unrouted)
N$50  (2 unrouted)
N$51  (2 unrouted)
N$52  (2 unrouted)
N$53  (2 unrouted)
N$55  (2 unrouted)
N$56  (2 unrouted)
N$57  (2 unrouted)
N$58  (2 unrouted)
N$59  (2 unrouted)
N$60  (2 unrouted)
N$61  (2 unrouted)
N$62  (2 unrouted)
N$63  (2 unrouted)
N$64  (2 unrouted)
N$65  (2 unrouted)
N$66  (2 unrouted)
N$67  (2 unrouted)
N$68  (2 unrouted)
N$69  (2 unrouted)
N$71  (2 unrouted)
N$72  (2 unrouted)
N$73  (2 unrouted)
N$74  (2 unrouted)
N$75  (1 unrouted)
N$76  (2 unrouted)
N$77  (2 unrouted)
N$78  (2 unrouted)
N$80  (2 unrouted)
N$81  (2 unrouted)
N$82  (2 unrouted)
N$83  (2 unrouted)
N$84  (2 unrouted)
N$85  (2 unrouted)
N$86  (2 unrouted)
N$87  (2 unrouted)
N$88  (2 unrouted)
N$89  (2 unrouted)
N$90  (2 unrouted)
N$91  (2 unrouted)
N$92  (2 unrouted)
N$93  (2 unrouted)
N$94  (2 unrouted)
N$95  (2 unrouted)
N$96  (2 unrouted)
N$97  (2 unrouted)
N$98  (2 unrouted)
N$99  (2 unrouted)
N$100  (2 unrouted)
N$101  (2 unrouted)
N$102  (2 unrouted)
N$103  (2 unrouted)
N$104  (2 unrouted)
N$105  (2 unrouted)
N$106  (1 unrouted)
N$107  (2 unrouted)
N$108  (2 unrouted)
N$109  (2 unrouted)
N$110  (2 unrouted)
N$111  (2 unrouted)
N$112  (2 unrouted)
N$113  (2 unrouted)
N$114  (2 unrouted)
N$115  (2 unrouted)
N$116  (2 unrouted)
N$117  (2 unrouted)
N$118  (2 unrouted)
N$119  (2 unrouted)
N$120  (2 unrouted)
N$121  (2 unrouted)
N$135  (1 unrouted)
N$136  (1 unrouted)
N$140  (1 unrouted)
N$141  (1 unrouted)
N$142  (1 unrouted)
N$144  (1 unrouted)
N$145  (1 unrouted)
N$149  (1 unrouted)
N$151  (1 unrouted)
N$152  (1 unrouted)
N$154  (1 unrouted)
N$156  (1 unrouted)
N$157  (1 unrouted)
N$162  (1 unrouted)
PA0/WKUP  (1 unrouted)
RED1  (9 unrouted)
RED2  (10 unrouted)
RED3  (9 unrouted)
RED4  (9 unrouted)
RED5  (8 unrouted)
RED6  (8 unrouted)
RED7  (9 unrouted)
RED8  (9 unrouted)
RED9  (10 unrouted)
RED10  (8 unrouted)
RED11  (9 unrouted)
RED12  (8 unrouted)
RESET  (4 unrouted)
ROW0  (35 unrouted)
ROW1  (36 unrouted)
ROW2  (36 unrouted)
ROW3  (33 unrouted)
ROW4  (34 unrouted)
ROW5  (26 unrouted)
SCK  (7 unrouted)
SCL  (2 unrouted)
SDA  (2 unrouted)
SYNC  (1 unrouted)
USB_DN  (2 unrouted)
USB_DP  (2 unrouted)
VCC_1  (9 unrouted)
VCC_2  (35 unrouted)
VCC_LED  (12 unrouted)
VREF+  (2 unrouted)
XB1  (1 unrouted)
XB2  (1 unrouted)
XB3  (1 unrouted)
XB4  (1 unrouted)
XB5  (1 unrouted)
XB6  (1 unrouted)
XB7  (1 unrouted)
XB8  (1 unrouted)
XB9  (1 unrouted)
XB10  (1 unrouted)
XB11  (1 unrouted)
XB12  (1 unrouted)
XG1  (1 unrouted)
XG2  (1 unrouted)
XG3  (1 unrouted)
XG4  (1 unrouted)
XG5  (1 unrouted)
XG6  (1 unrouted)
XG7  (1 unrouted)
XG8  (1 unrouted)
XG9  (1 unrouted)
XG10  (1 unrouted)
XG11  (1 unrouted)
XG12  (1 unrouted)
XR1  (1 unrouted)
XR2  (1 unrouted)
XR3  (1 unrouted)
XR4  (1 unrouted)
XR5  (1 unrouted)
XR6  (1 unrouted)
XR7  (1 unrouted)
XR8  (1 unrouted)
XR9  (1 unrouted)
XR10  (1 unrouted)
XR11  (1 unrouted)
XR12  (1 unrouted)
Y1I  (2 unrouted)
Y1O  (2 unrouted)
Y2I  (2 unrouted)
Y2O  (2 unrouted)

## Text on the board
bPlace: DIP / SW | USB / UDB | LED | KNOB